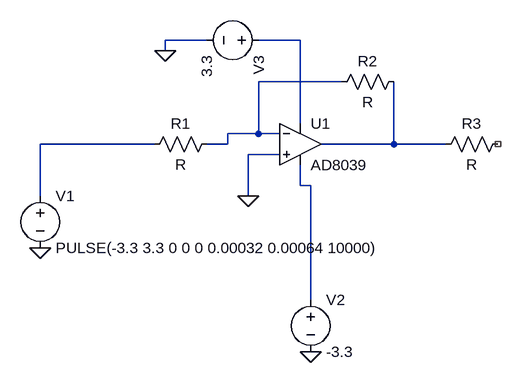
[diagram p0: schematic Draft1.asc]
Draft1.asc, the LTspice schematic file:
Version 4
SHEET 1 880 680
WIRE 272 -112 208 -112
WIRE 416 -112 352 -112
WIRE 208 -96 208 -112
WIRE 480 -48 352 -48
WIRE 416 16 416 -112
WIRE 352 32 352 -48
WIRE 352 32 304 32
WIRE 384 32 352 32
WIRE 192 48 16 48
WIRE 304 48 304 32
WIRE 304 48 272 48
WIRE 560 48 560 -48
WIRE 560 48 448 48
WIRE 640 48 560 48
WIRE 384 64 336 64
WIRE 416 112 416 80
WIRE 432 112 416 112
WIRE 16 128 16 48
WIRE 336 128 336 64
WIRE 432 288 432 112
FLAG 16 208 0
FLAG 432 368 0
FLAG 208 -96 0
FLAG 336 128 0
SYMBOL voltage 16 112 R0
WINDOW 123 0 0 Left 0
WINDOW 39 0 0 Left 0
SYMATTR InstName V1
SYMATTR Value PULSE(-3.3 3.3 0 0 0 0.00032 0.00064 10000)
SYMBOL OpAmps\\AD8039 416 -16 R0
SYMATTR InstName U1
SYMBOL voltage 432 272 R0
WINDOW 123 0 0 Left 0
WINDOW 39 0 0 Left 0
SYMATTR InstName V2
SYMATTR Value -3.3
SYMBOL voltage 368 -112 R90
WINDOW 123 0 0 Left 0
WINDOW 39 0 0 Left 0
SYMATTR InstName V3
SYMATTR Value 3.3
SYMBOL res 288 32 R90
WINDOW 0 0 56 VBottom 2
WINDOW 3 32 56 VTop 2
SYMATTR InstName R1
SYMBOL res 576 -64 R90
WINDOW 0 0 56 VBottom 2
WINDOW 3 32 56 VTop 2
SYMATTR InstName R2
SYMBOL res 736 32 R90
WINDOW 0 0 56 VBottom 2
WINDOW 3 32 56 VTop 2
SYMATTR InstName R3

The netlist it stands for:
* Draft1.asc
V1 N003 0 PULSE(-3.3 3.3 0 0 0 0.00032 0.00064 10000)
XU1 0 N002 N001 N005 N004 AD8039  ; pins In+ In- V+ V- OUT
V2 N005 0 -3.3
V3 N001 0 3.3
R1 N002 N003 R
R2 N004 N002 R
R3 NC_01 N004 R
.backanno
.end